# EAGLE design emonDCduo-ESP v1.3 (EAGLE 8.3.2)
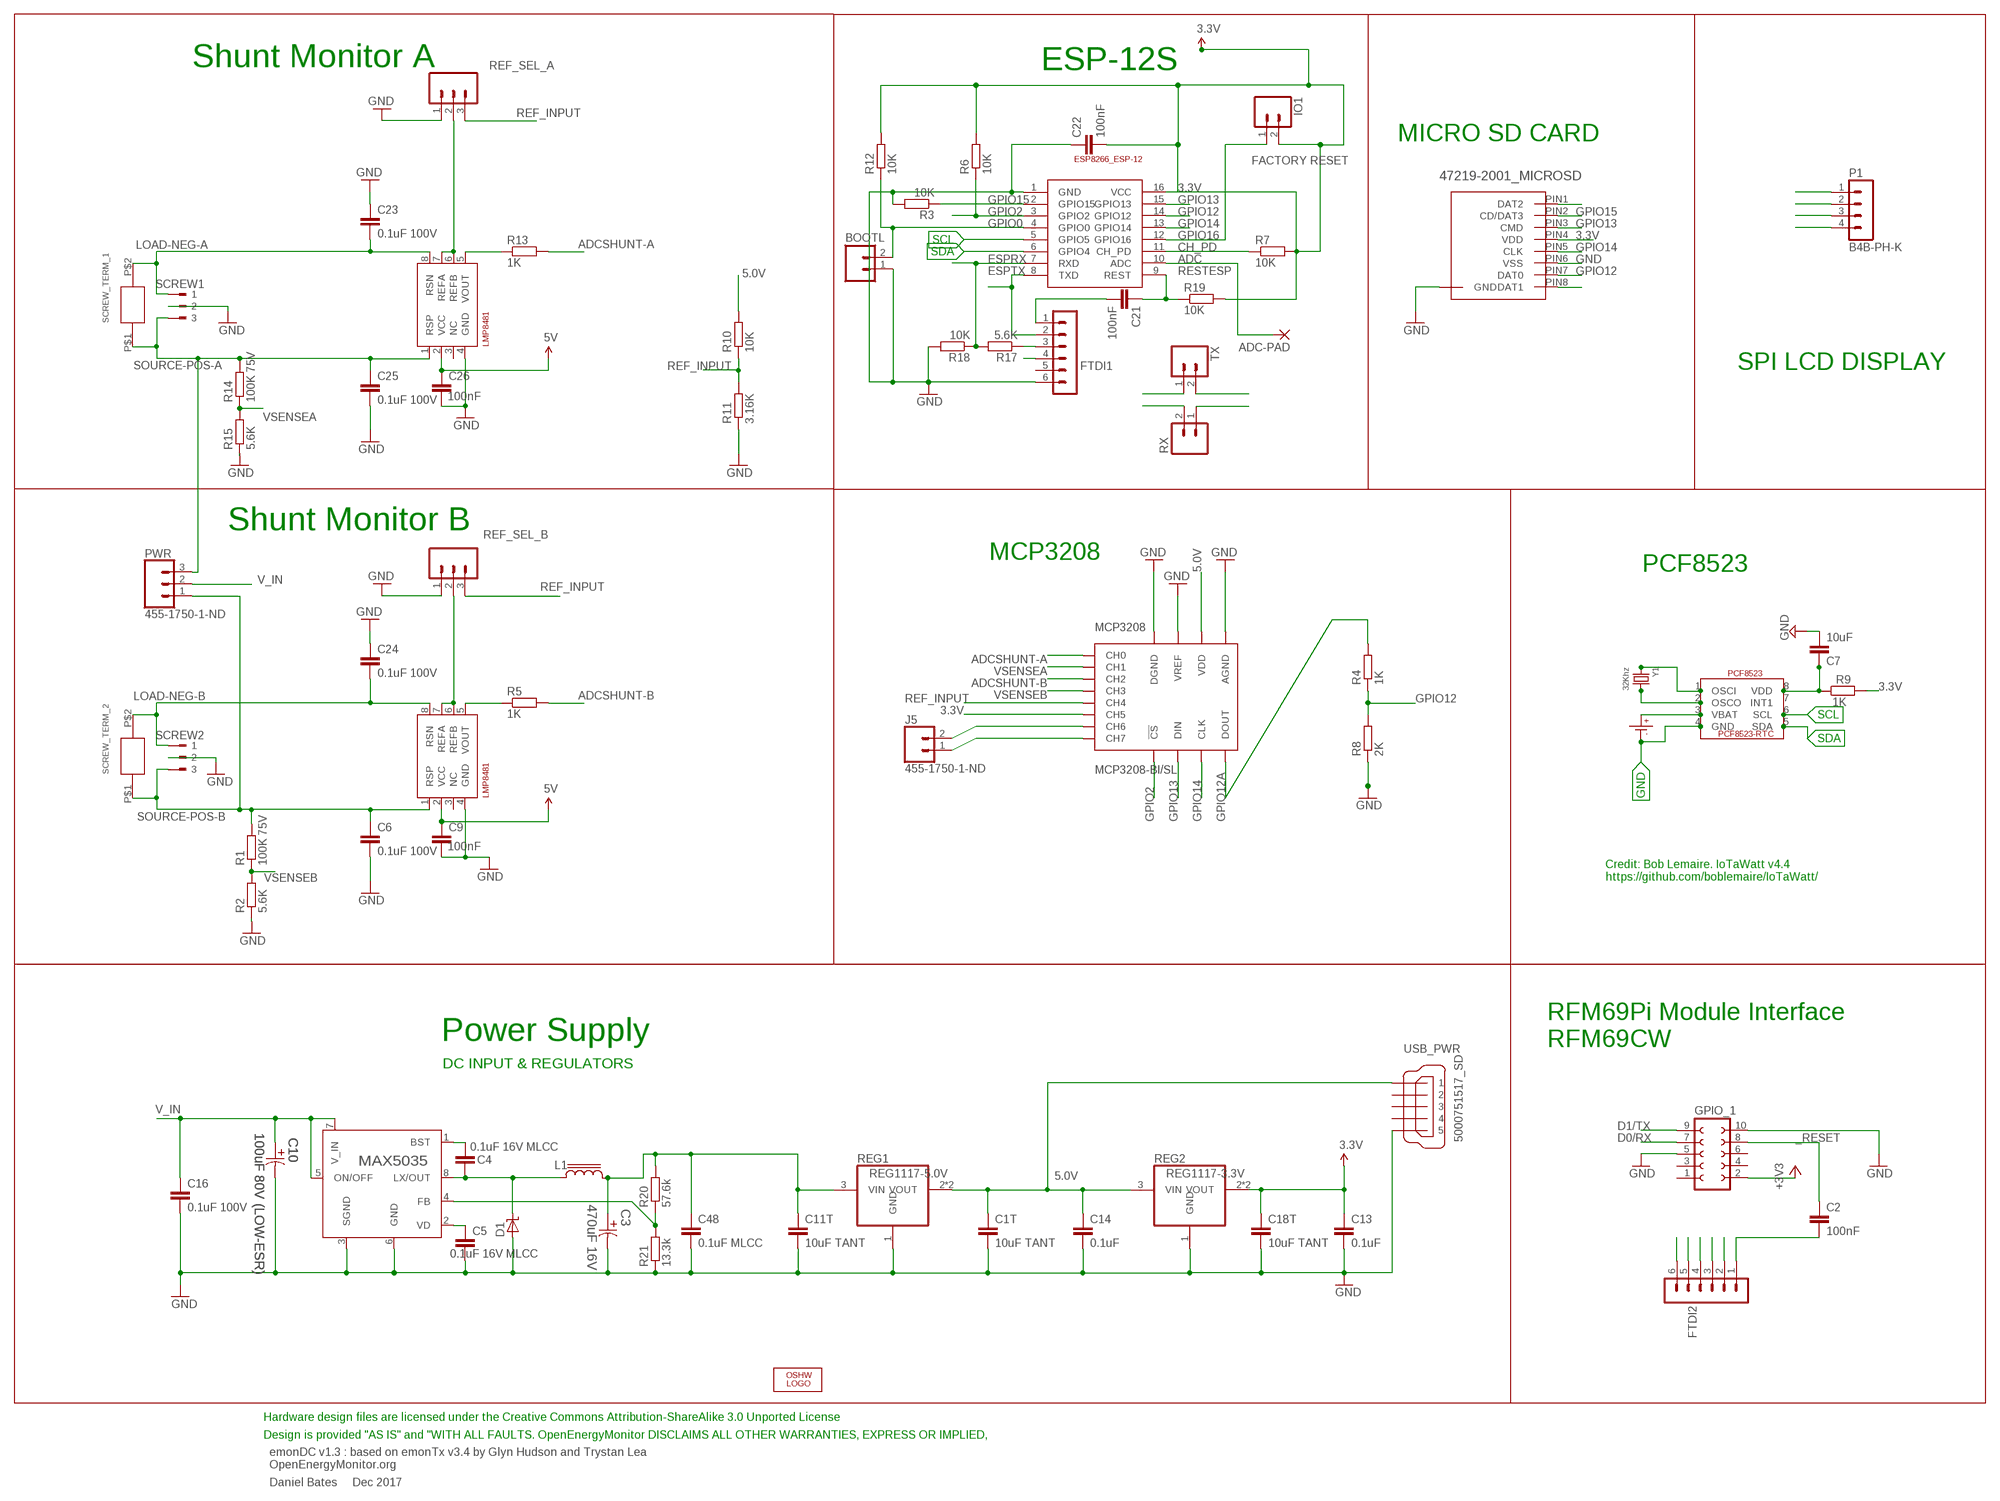
[diagram p0: schematic, sheet 1]

## Parts
ADC-PAD  2,15/1,0  [2,15/1,0]
BOOTL  M02PTH  [1X02]
C1T  10uF TANT  C-EUC0603  [C0603]
C2  100nF  C-EUC0603  [C0603]
C3  470uF 16V  EEE-FK1C471P-CASE-F  [CAPAE830X1050N]
C4  0.1uF 16V MLCC  C-EUC0603  [C0603]
C5  0.1uF 16V MLCC  C-EUC0603  [C0603]
C6  0.1uF 100V  C-EUC0603  [C0603]
C7  10uF  C-EUC0603  [C0603]
C9  100nF  C-EUC0603  [C0603]
C10  100uF 80V (LOW-ESR)  EEV-FK1K101Q-CASE-H13  [CAPAE1350X1400N]
C11T  10uF TANT  C-EUC0603  [C0603]
C13  0.1uF  C-EUC0603  [C0603]
C14  0.1uF  C-EUC0603  [C0603]
C16  0.1uF 100V  C-EUC0603  [C0603]
C18T  10uF TANT  C-EUC0603  [C0603]
C21  100nF  C-EUC0603  [C0603]
C22  100nF  C-EUC0603  [C0603]
C23  0.1uF 100V  C-EUC0603  [C0603]
C24  0.1uF 100V  C-EUC0603  [C0603]
C25  0.1uF 100V  C-EUC0603  [C0603]
C26  100nF  C-EUC0603  [C0603]
C48  0.1uF MLCC  C-EUC0603  [C0603]
CR1220  CR1220SMD  [CR1220SMD]
D1  MBRS1100T3G  [SMB_1]
ESP-12  ESP8266_ESP-12  [ESP8266-ESP12]
FTDI1  FTDI  MA06-1  [MA06-1]
FTDI2  FTDI  MA06-1  [MA06-1]
GPIO_1  FE05-2  [FE05-2]
IO1  M02PTH  [1X02]
J5  455-1750-1-ND  CONN_02  [1X02]
L1  SRR1208  [SSR1208]
LOGO1  OSHW_LOGO_6MILX0200-NT  [OSHW_6X200_NOTEXT]
MCP3208  MCP3208-BI/SL  [SOIC16]
P1  B4B-PH-K  [B4B-PH-K]
PCF8523  PCF8523_RTC  [SOIC_8]
PWR  455-1750-1-ND  CONN_03  [1X03]
R1  100K 75V  R-EU_R0603  [R0603]
R2  5.6K  R-EU_R0603  [R0603]
R3  10K  R-EU_R0603  [R0603]
R4  1K  R-EU_R0603  [R0603]
R5  1K  R-EU_R0603  [R0603]
R6  10K  R-EU_R0603  [R0603]
R7  10K  R-EU_R0603  [R0603]
R8  2K  R-EU_R0603  [R0603]
R9  1K  R-EU_R0603  [R0603]
R10  10K  R-EU_0309/12  [0309/12]
R11  3.16K  R-EU_0309/12  [0309/12]
R12  10K  R-EU_R0603  [R0603]
R13  1K  R-EU_R0603  [R0603]
R14  100K 75V  R-EU_R0603  [R0603]
R15  5.6K  R-EU_R0603  [R0603]
R17  5.6K  R-EU_R0603  [R0603]
R18  10K  R-EU_R0603  [R0603]
R19  10K  R-EU_R0603  [R0603]
R20  57.6k  R-EU_R0603  [R0603]
R21  13.3k  R-EU_R0603  [R0603]
REF_SEL_A  455-1750-1-ND  CONN_03  [1X03]
REF_SEL_B  455-1750-1-ND  CONN_03  [1X03]
REG0  MAX5035  [21-0111D_SBE-14]
REG1  REG1117-5.0V  REG1117-VOUT4  [SOT223]
REG2  REG1117-3.3V  REG1117-VOUT4  [SOT223]
RX  M02PTH  [1X02]
SCREW1  180-3  [180-3]
SCREW2  180-3  [180-3]
SCREW_TERM_1  EBW_SERIES_15.2MM  [EBW_SERIES_15.2MM]
SCREW_TERM_2  EBW_SERIES_15.2MM  [EBW_SERIES_15.2MM]
SHUNTMON-A  LMP8481  LMP8481-H  [S-PDSO-G08]
SHUNTMON-B  LMP8481  LMP8481-H  [S-PDSO-G08]
TX  M02PTH  [1X02]
U$4  47219-2001_MICROSD  [47219-2001_MICROSD]
USB_PWR  5000751517_SD  [5000751517_SD]
Y1  32Khz  CRYSTAL8X3.8SMT  [CRYSTAL_8X3.8]

## Nets
3.3V: C13.1 C18T.1 C22.2 ESP-12.16(VCC) GPIO_1.2 IO1.2 MCP3208.6(CH5) P1.3 R6.2 R7.2 R9.2 R12.2 R19.2 REG2.2(VOUT) REG2.4(VOUT) U$4.PIN4(VDD) ; supply symbol labelled +3V3
5.0V [power]: C1T.1 C9.1 C14.1 C26.1 FTDI1.4 FTDI2.4 MCP3208.16(VDD) R10.2 REG1.2(VOUT) REG1.4(VOUT) REG2.3(VIN) SHUNTMON-A.2(VCC) SHUNTMON-B.2(VCC) USB_PWR.VBUS ; supply symbol labelled 5V
6.5V: C3.1 C11T.1 C48.1 L1.2 R20.2 REG1.3(VIN)
_RESET: C2.1 GPIO_1.8
ADC: ADC-PAD.1(P) ESP-12.10(ADC)
ADCSHUNT-A: MCP3208.1(CH0) R13.2
ADCSHUNT-B: MCP3208.3(CH2) R5.2
BST: C4.1 REG0.1(BST)
CH6: J5.2 MCP3208.7(CH6)
CH7: J5.1 MCP3208.8(CH7)
CH_PD: ESP-12.11(CH_PD) R7.1
D0/RX: FTDI2.2 GPIO_1.7 TX.2
D1/TX: FTDI2.3 GPIO_1.9 RX.1
ESPRX: ESP-12.7(RXD) R17.2 R18.1 RX.2
ESPTX: ESP-12.8(TXD) FTDI1.2 TX.1
FB: R20.1 R21.2 REG0.4(FB)
GND [thin_power]: BOOTL.1 C1T.2 C3.2 C5.2 C6.2 C7.2 C9.2 C10.2 C11T.2 C13.2 C14.2 C16.2 C18T.2 C22.1 C23.1 C24.1 C25.2 C26.2 C48.2 CR1220.P-(P$-) D1.A ESP-12.1(GND) FTDI1.6 FTDI2.6 GPIO_1.5 GPIO_1.10 MCP3208.9(DGND) MCP3208.14(AGND) MCP3208.15(VREF) P1.4 PCF8523.4(GND) R2.1 R3.2 R8.1 R11.1 R15.1 R18.2 R21.1 REF_SEL_A.1 REF_SEL_B.1 REG0.3(SGND) REG0.6(GND) REG1.1(GND) REG2.1(GND) SCREW1.2 SCREW2.2 SHUNTMON-A.4(GND) SHUNTMON-B.4(GND) U$4.P$1(GND) U$4.P$2(GND) U$4.P$3(GND) U$4.P$4(GND) U$4.PIN6(VSS) USB_PWR.GND1 USB_PWR.GND2 USB_PWR.GND3
GPIO0: BOOTL.2 ESP-12.4(GPIO0) R12.1
GPIO2: ESP-12.3(GPIO2) MCP3208.10(!CS) R6.1
GPIO12: ESP-12.14(GPIO12) R4.1 R8.2 U$4.PIN7(DAT0)
GPIO12A: MCP3208.12(DOUT) R4.2
GPIO13: ESP-12.15(GPIO13) MCP3208.11(DIN) U$4.PIN3(CMD)
GPIO14: ESP-12.13(GPIO14) MCP3208.13(CLK) U$4.PIN5(CLK)
GPIO15 [thin_power]: ESP-12.2(GPIO15) R3.1 U$4.PIN2(CD/DAT3)
GPIO16: ESP-12.12(GPIO16) IO1.1
LOAD-NEG-A: C23.2 SCREW1.1 SCREW_TERM_1.P$2 SHUNTMON-A.8(RSN)
LOAD-NEG-B: C24.2 SCREW2.1 SCREW_TERM_2.P$2 SHUNTMON-B.8(RSN)
LX: C4.2 D1.C L1.1 REG0.8(LX/OUT)
N$4: R13.1 SHUNTMON-A.5(VOUT)
N$6: R5.1 SHUNTMON-B.5(VOUT)
N$7: U$4.PIN1(DAT2)
N$10: C7.1 PCF8523.8(VDD) R9.1
N$20: FTDI2.5
N$30: C21.2 FTDI1.1
N$32: U$4.PIN8(DAT1)
N$36: FTDI1.3 R17.1
N$43: CR1220.P+(P$+) PCF8523.3(VBAT)
N$44: PCF8523.2(OSCO) Y1.P$4
N$45: PCF8523.1(OSCI) Y1.P$1
N$301: C2.2 FTDI2.1
REF_A_INPUT: REF_SEL_A.2 SHUNTMON-A.6(REFB) SHUNTMON-A.7(REFA)
REF_B_INPUT [thin_power]: REF_SEL_B.2 SHUNTMON-B.6(REFB) SHUNTMON-B.7(REFA)
REF_INPUT: MCP3208.5(CH4) R10.1 R11.2 REF_SEL_A.3 REF_SEL_B.3
RESTESP: C21.1 ESP-12.9(REST) R19.1
SCL: ESP-12.5(GPIO5) P1.2 PCF8523.6(SCL)
SDA: ESP-12.6(GPIO4) P1.1 PCF8523.5(SDA)
SOURCE-POS-A: C25.1 PWR.3 R14.2 SCREW1.3 SCREW_TERM_1.P$1 SHUNTMON-A.1(RSP)
SOURCE-POS-B: C6.1 PWR.1 R1.2 SCREW2.3 SCREW_TERM_2.P$1 SHUNTMON-B.1(RSP)
V_IN: C10.1 C16.1 PWR.2 REG0.5(ON/OFF) REG0.7(V_IN)
VD: C5.1 REG0.2(VD)
VSENSEA: MCP3208.2(CH1) R14.1 R15.2
VSENSEB: MCP3208.4(CH3) R1.1 R2.2
Unconnected: FTDI1.5 GPIO_1.1 GPIO_1.3 GPIO_1.4 GPIO_1.6 PCF8523.7(INT1) SHUNTMON-A.3(NC) SHUNTMON-B.3(NC) USB_PWR.D+ USB_PWR.D- USB_PWR.ID

## Notes on the sheet
- Shunt Monitor A | ESP-12S
- MICRO SD CARD
- FACTORY RESET
- SPI LCD DISPLAY
- Shunt Monitor B
- MCP3208
- PCF8523
- Credit: Bob Lemaire. IoTaWatt v4.4
  https://github.com/boblemaire/IoTaWatt/
- Power Supply
- RFM69Pi Module Interface
  RFM69CW
- DC INPUT & REGULATORS
- Hardware design files are licensed under the Creative Commons Attribution-ShareAlike 3.0 Unported License
- Design is provided "AS IS" and "WITH ALL FAULTS. OpenEnergyMonitor DISCLAIMS ALL OTHER WARRANTIES, EXPRESS OR IMPLIED,
- emonDC v1.3 : based on emonTx v3.4 by Glyn Hudson and Trystan Lea
  OpenEnergyMonitor.org
- Daniel Bates     Dec 2017

## Library data of the parts
ADC-PAD = wirepad:2,15/1,0: THROUGH-HOLE PAD
BOOTL IO1 RX TX = SparkFun:M02: Header 2 Standard 2-pin 0.1" header. Use with straight break away headers (SKU : PRT-00116), right angle break away headers (PRT-00553), swiss pins (PRT-00743), machine pins (PRT-00117), and female headers (PRT-00115). Molex polarized connector foot print use with SKU : PRT-08233 with associated crimp pins and housings.
C1T C2 C4 C5 C7 C11T C13 C14 C16 C18T C21 C22 C48 = rcl:C-EU: CAPACITOR, European symbol
C3 = Panasonic-EEEFK_EEEFP:EEE-: Aluminum Electrolytic Capacitors,Surface Mount Type; MPN: EEE-FK1C471P; OC_FARNELL: 9695710; OC_NEWARK: 96K9385; PACKAGE: CASE-F; SUPPLIER: PANASONIC; TOLERANCE: ±20 %; VALUE: 470UF; VOLTAGERATING: 16V
C6 C9 C23-C26 = rcl:C-EU: CAPACITOR, European symbol; MPN: C1608X7S2A104K080AB
C10 = Panasonic-EEE-EEV-EEF-ECQ:EEV-: Aluminum Electrolytic Capacitors,Surface Mount Type; MPN: EEVFK1K101Q; OC_FARNELL: 9696113; OC_NEWARK: 96K9484; SUPPLIER: PANASONIC; TOLERANCE: ±20 %; VALUE: 100UF; VOLTAGERATING: 80V
CR1220 = IotaWatt_parts:CR1220SMD: CR1220 Battery SMD; MPN: Harwin S8411-45R
D1 = diodes:MBRS1100T3G: MBRS1100T3G 100V 1A Freewheeling Diode; MPN: MBRS1100T3G
ESP-12 = ESP8266-ESP12:ESP8266_ESP-12
FTDI1 FTDI2 = JeeLabs:MA06-1: PIN HEADER
GPIO_1 = con-lsta:FE05-2: FEMALE HEADER; OC_FARNELL: unknown; OC_NEWARK: unknown
J5 = SparkFun-Connectors:CONN_02: Multi connection point. Often used as Generic Header-pin footprint for 0.1 inch spaced/style header connections On any of the 0.1 inch spaced packages, you can populate with these: Break Away Headers - Straight <https://www.sparkfun.com/products/116> (PRT-00116) Break Away Male Headers - Right Angle <https://www.sparkfun.com/products/553> (PRT-00553) Female Headers <https://www.sparkfun.com/products/115> (PRT-00115) Break Away Headers - Machine Pin <https://www.sparkfun.com/products/117> (PRT-00117) Break Away Female Headers - Swiss Machine Pin <https://www.sparkfun.com/products/743> (PRT-00743) For SCREWTERMINALS and SPRING TERMINALS visit here: Screw Terimnals on SparkFun.com <https://www.sparkfun.com/search/results?term=Screw+Terminals> (5mm/3.5mm/2.54mm spacing) This device is also useful as a general connection point to wire up your design to another part of your project. Our various solder wires solder well into these plated through hole pads. Hook-Up Wire - Assortment (Stranded, 22 AWG) <https://www.sparkfun.com/products/11375> (PRT-11375) Hook-Up Wire - Assortment (Solid Core, 22 AWG) <https://www.sparkfun.com/products/11367> (PRT-11367) View the entire wire category on our website here <https://www.sparkfun.com/categories/141> Special notes: Molex polarized connector foot print use with: PRT-08233 with associated crimp pins and housings. 2.54_SCREWTERM for use with PRT-10571. 3.5mm Screw Terminal footprints for PRT-08084 5mm Screw Terminal footprints for use with PRT-08432
L1 = inductor-bourns:SRR1208: POWER INDUCTOR; MPN: SRR1208-151YL
LOGO1 = ohw-logo:OSHW_LOGO_6MIL; OC_FARNELL: unknown
MCP3208 = MCP3208:MCP3208
P1 = jst-ph:B4B-PH-K: HEADER
PCF8523 = IotaWatt_parts:PCF8523_RTC: PCF8523-RTC SOIC-8
PWR = SparkFun-Connectors:CONN_03: Multi connection point. Often used as Generic Header-pin footprint for 0.1 inch spaced/style header connections On any of the 0.1 inch spaced packages, you can populate with these: Break Away Headers - Straight <https://www.sparkfun.com/products/116> (PRT-00116) Break Away Male Headers - Right Angle <https://www.sparkfun.com/products/553> (PRT-00553) Female Headers <https://www.sparkfun.com/products/115> (PRT-00115) Break Away Headers - Machine Pin <https://www.sparkfun.com/products/117> (PRT-00117) Break Away Female Headers - Swiss Machine Pin <https://www.sparkfun.com/products/743> (PRT-00743) Stackable Header - 3 Pin (Female, 0.1") <https://www.sparkfun.com/products/13875> (PRT-13875) For SCREWTERMINALS and SPRING TERMINALS visit here: Screw Terimnals on SparkFun.com <https://www.sparkfun.com/search/results?term=Screw+Terminals> (5mm/3.5mm/2.54mm spacing) This device is also useful as a general connection point to wire up your design to another part of your project. Our various solder wires solder well into these plated through hole pads. Hook-Up Wire - Assortment (Stranded, 22 AWG) <https://www.sparkfun.com/products/11375> (PRT-11375) Hook-Up Wire - Assortment (Solid Core, 22 AWG) <https://www.sparkfun.com/products/11367> (PRT-11367) View the entire wire category on our website here <https://www.sparkfun.com/categories/141> Special notes: Molex polarized connector foot print use with SKU : PRT-08232 with associated crimp pins and housings.; PROD_ID: XXX-00000
R1 R14 = rcl:R-EU_: RESISTOR, European symbol; MPN: MCWR06X1003FTL
R2 R4 R8 R15 = rcl:R-EU_: RESISTOR, European symbol; MPN: MCWR06X5901FTL
R3 R5-R7 R9-R13 R17-R21 = rcl:R-EU_: RESISTOR, European symbol
REF_SEL_A REF_SEL_B = SparkFun-Connectors:CONN_03: Multi connection point. Often used as Generic Header-pin footprint for 0.1 inch spaced/style header connections On any of the 0.1 inch spaced packages, you can populate with these: Break Away Headers - Straight <https://www.sparkfun.com/products/116> (PRT-00116) Break Away Male Headers - Right Angle <https://www.sparkfun.com/products/553> (PRT-00553) Female Headers <https://www.sparkfun.com/products/115> (PRT-00115) Break Away Headers - Machine Pin <https://www.sparkfun.com/products/117> (PRT-00117) Break Away Female Headers - Swiss Machine Pin <https://www.sparkfun.com/products/743> (PRT-00743) Stackable Header - 3 Pin (Female, 0.1") <https://www.sparkfun.com/products/13875> (PRT-13875) For SCREWTERMINALS and SPRING TERMINALS visit here: Screw Terimnals on SparkFun.com <https://www.sparkfun.com/search/results?term=Screw+Terminals> (5mm/3.5mm/2.54mm spacing) This device is also useful as a general connection point to wire up your design to another part of your project. Our various solder wires solder well into these plated through hole pads. Hook-Up Wire - Assortment (Stranded, 22 AWG) <https://www.sparkfun.com/products/11375> (PRT-11375) Hook-Up Wire - Assortment (Solid Core, 22 AWG) <https://www.sparkfun.com/products/11367> (PRT-11367) View the entire wire category on our website here <https://www.sparkfun.com/categories/141> Special notes: Molex polarized connector foot print use with SKU : PRT-08232 with associated crimp pins and housings.; MF: MULTICOMP; MPN: 2212S-02SG-85; OC_FARNELL: 1593458; PROD_ID: XXX-00000
REG0 = MAX5035:MAX5035: SWITCHING REGULATOR 5.0V 1.0A; MANUFACTURER_PART_NUMBER: MAX5035EASA+; MPN: MAX5035EASA+; VENDOR: MAXIM
REG1 = burr-brown:REG1117-VOUT4: 800mA and 1A Low Dropout (LDO) Positive Regulator 1.8V, 2.5V, 2.85V, 3.3V, 5V, and Adj; MF: TEXAS INSTRUMENTS; MPN: REG1117-5.0; OC_FARNELL: 1097566; OC_NEWARK: 14P6981
REG2 = burr-brown:REG1117-VOUT4: 800mA and 1A Low Dropout (LDO) Positive Regulator 1.8V, 2.5V, 2.85V, 3.3V, 5V, and Adj; MF: TEXAS INSTRUMENTS; MPN: REG1117-3.3; OC_FARNELL: 1097566; OC_NEWARK: 14P6981
SCREW1 SCREW2 = con-weidmueller-sl35:180-3: WEIDMUELLER CLAMP CONNECTOR; OC_FARNELL: unknown; OC_NEWARK: unknown
SCREW_TERM_1 SCREW_TERM_2 = EBW series shunt:EBW_SERIES_15.2MM
SHUNTMON-A = lmp8481b:LMP8481: LMP8481MM-H/NOPB 100V/V; MF: TEXAS INSTRUMENTS; MPN: LMP8481MME-S/NOPB; OC_FARNELL: 2322044
SHUNTMON-B = lmp8481b:LMP8481: LMP8481MM-H/NOPB 100V/V; MF: TEXAS INSTRUMENTS; MPN: LMP8481MME-H/NOPB; OC_FARNELL: 2322044
U$4 = MOLEX 47219-2001:47219-2001_MICROSD
USB_PWR = 5000751517_sd:5000751517_SD
Y1 = microbuilder:CRYSTAL: Crystals HC49UP - Surface Mount Crystal 4.0MHz 18pF +/-30ppm Surface Mount Crystal [Digikey: 535-9857-1-ND] 12.0 MHz Surface Mount Crystal [Digikey: 535-9869-6-ND] 25.0 MHz Surface Mount Crystal [Digikey: 535-9078-1-ND] 2.5 x 2.0mm - MEMs SMT Crystal 16.0 MHz 10pF 20ppm 2.5 x 2.0mm Crystal [Digikey -40-85°C: 535-10923-1-ND] 3.2 x 2.5mm - MEMs SMT Crystal 12.0 MHz 8pF 15ppm 3.2 x 2.5mm Crystal [Digikey: -10-70°C: 644-1047-1-ND -40-125°C: 644-1128-1-ND] 16.0 MHz 8pF 15ppm 3.2 x 2.5mm Crystal [Digikey: -10-70°C: 644-1049-1-ND -40-125°C: 644-1129-2-ND] 16.0 MHz 10pF 10ppm 3.2 x 2.5mm Crystal [Digikey: 644-1100-1-ND] 27.12 MHz 18pF 30ppm 3.2 x 2.5mm Crystal [Digikey: 887-1424-1-ND] 27.12MHz 10pF 10ppm 3.2 x 2.5mm Crystal [Digikey: 887-1329-1-ND] 4.9 x 1.8mm - MEMs SMT Crystal 32.768 KHz 12.5pF 20ppm 4.9 x 1.8mm Crystal [Digikey: SE2415CT-ND] 8.0 x 3.8mm - Surface Mount Crystal 32.768kHz 12.5pF 20ppm -40°C-85°C [Digikey: 535-9166-2-ND] Cylinder 32.768KHz Cylinder Crystal (2x6mm body) [Ex. Digikey: 300-8341-2-ND]

## Net classes
2 thin_power: width 0.254 mm

## Board
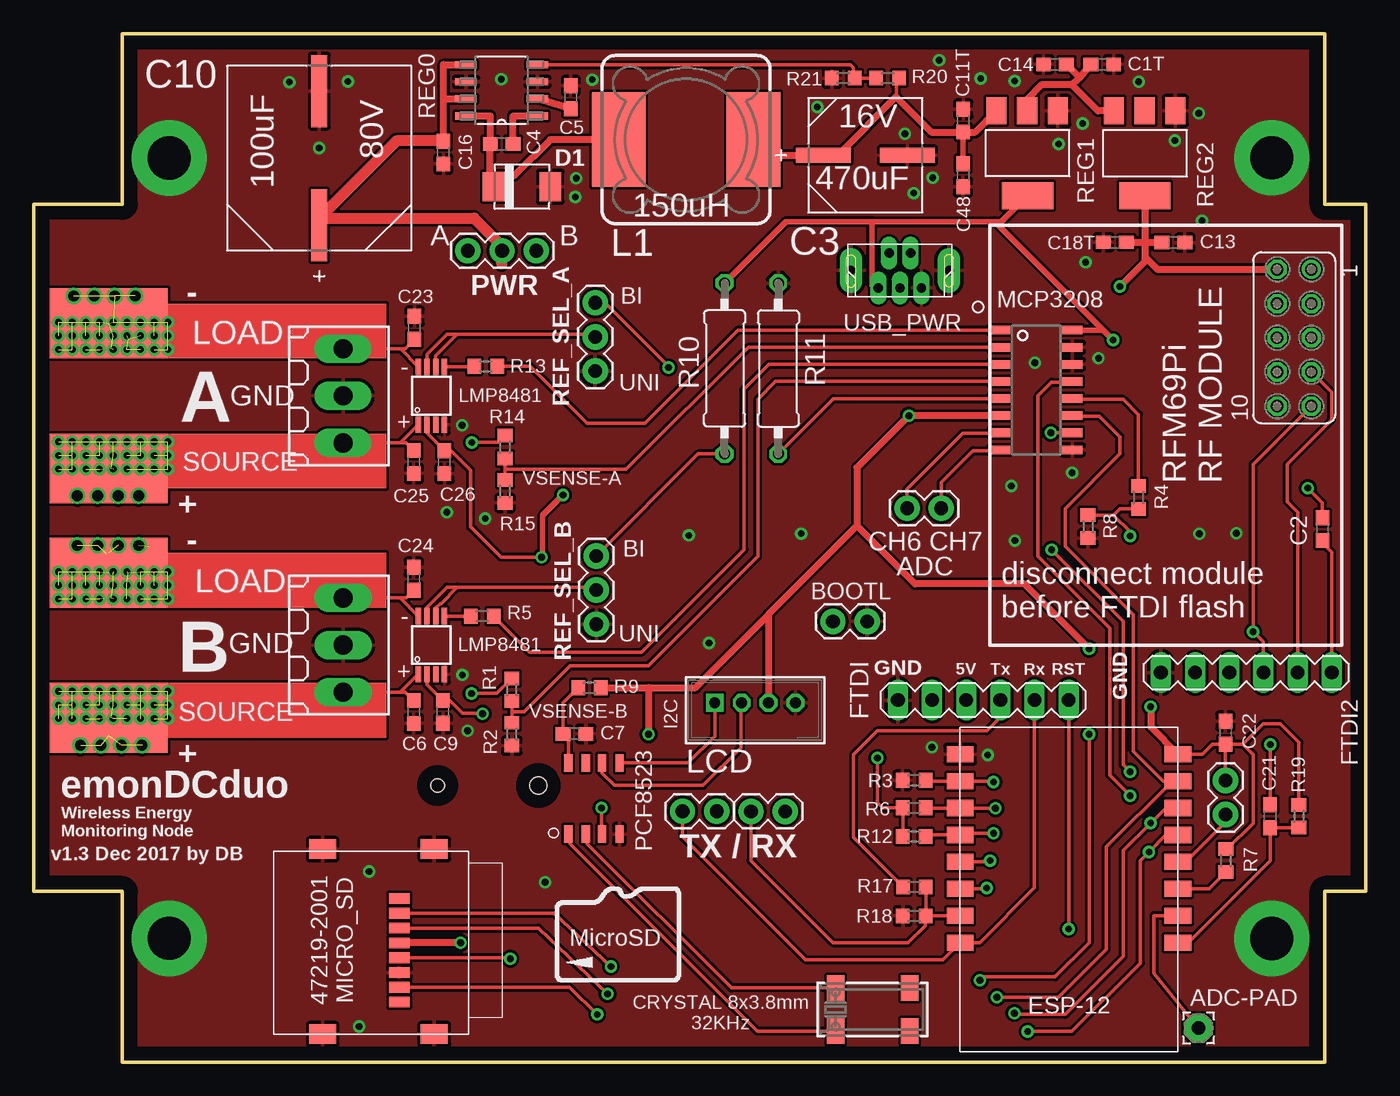
[diagram p1: board, top side]
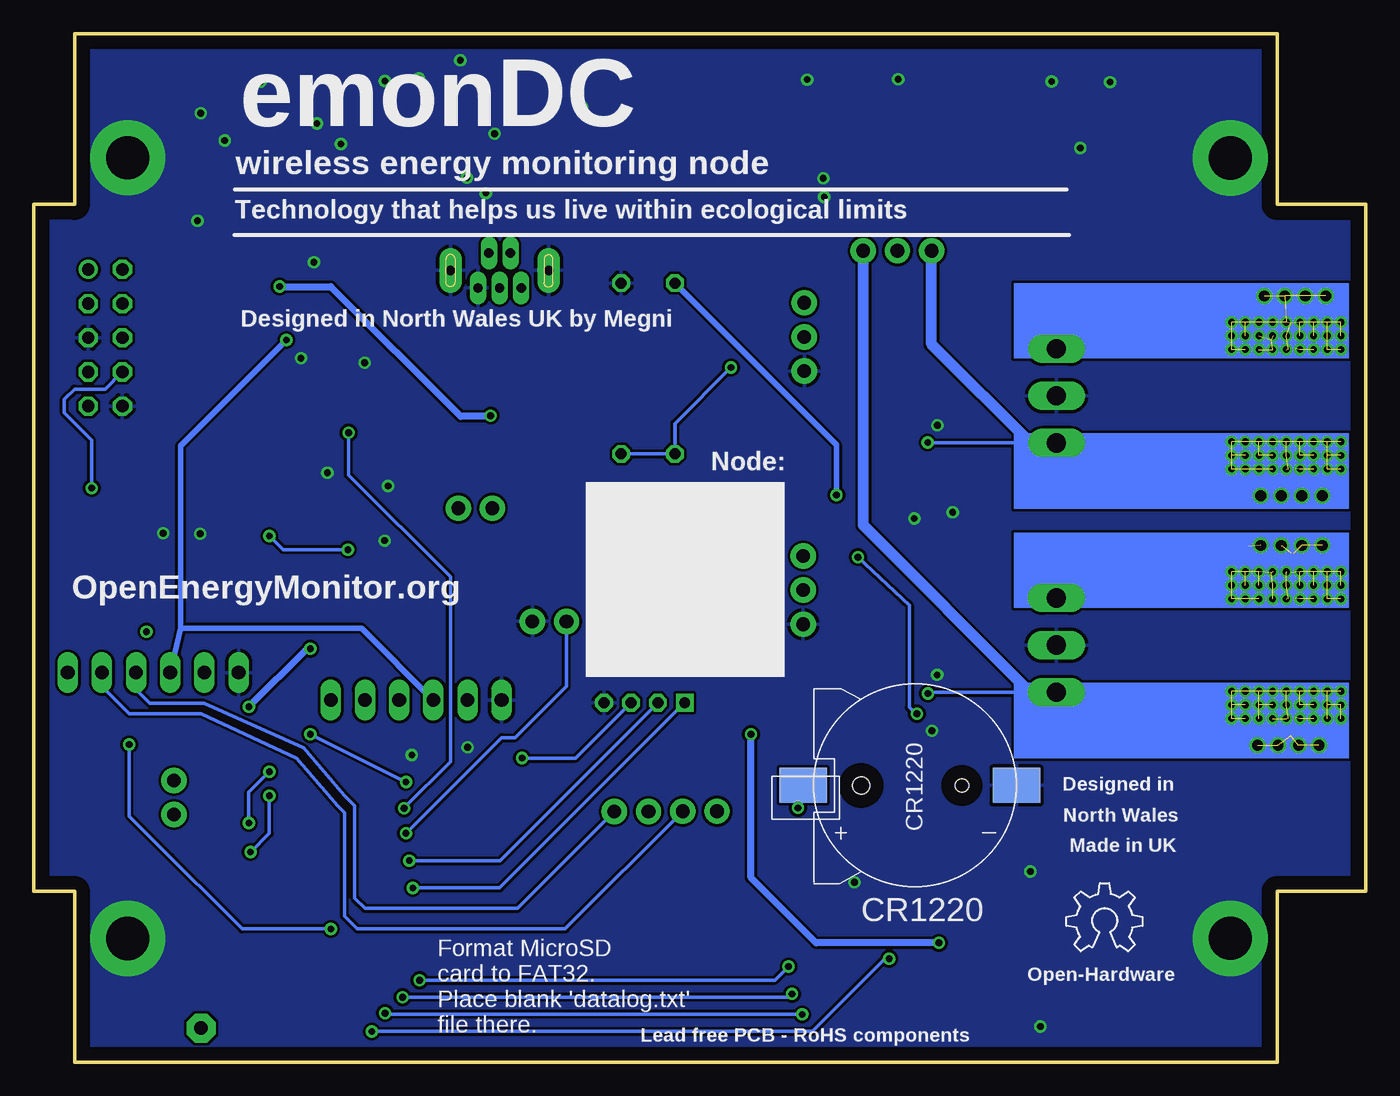
[diagram p2: board, bottom side, seen from below]

Size 99.06 x 76.45 mm. Coordinates in mm from the lower left corner, seen from the top.
Outline: 6.6,63.75 6.6,76.45 96.01,76.45 96.01,63.75 99.06,63.75 99.06,12.7 96.01,12.7 96.01,0 6.6,0 6.6,12.7 0,12.7 0,63.75 6.6,63.75
Copper layers (1*16): Top 0.035mm / dielectric 1.5mm / Bottom 0.035mm
Design rules "default *": minimum track width 10mil, minimum drill 19mil, track to track 8mil, track to pad 8mil, pad to pad 8mil, via to via 8mil, smd to smd 8mil, copper to edge 40mil, drill to drill 8mil, minimum pad ring 10mil, minimum via ring 8mil, stop-mask expansion 4mil, vias tented up to drill 0mil, thermal gap 10mil

### Footprints (pad centres in the part's own frame; a part is rotated, then mirrored left to right if it is on the bottom)
2,15/1,0 = drill 1.016 pad 2.159 octagon: 1 0,0
1X02 = drill 1.016 pad 1.88: 1 0,0; 2 2.54,0
C0603 = smd 1.1 x 1: 1 -0.85,0; 2 0.85,0
CAPAE830X1050N = smd 4.064 x 1.092: 1 -3.124,0; 2 3.124,0
CAPAE1350X1400N = smd 5.359 x 1.194: 1 -4.978,0; 2 4.978,0
CR1220SMD = smd 3.54 x 2.6: P+ 8.3,0; P- -7.55,0 | hole 1: -3.5,0 | hole 1.3: 4,0
SMB_1 = smd 1.62 x 2.18: A 2.11,0; C -2.11,0
ESP8266-ESP12 = smd 2 x 1.2: 1 16.2,2; 2 16.2,4; 3 16.2,6; 4 16.2,8; 5 16.2,10; 6 16.2,12; 7 16.2,14; 8 16.2,16; 9 0,16; 10 0,14; 11 0,12; 12 0,10; 13 0,8; 14 0,6; 15 0,4; 16 0,2
MA06-1 = drill 1.016 long: 1 0,0; 2 2.54,0; 3 5.08,0; 4 7.62,0; 5 10.16,0; 6 12.7,0
FE05-2 = drill 0.914: 1 -5.08,1.27 | drill 0.914 octagon: 2 -5.08,-1.27; 3 -2.54,1.27; 4 -2.54,-1.27; 5 0,1.27; 6 0,-1.27; 7 2.54,1.27; 8 2.54,-1.27; 9 5.08,1.27; 10 5.08,-1.27
SSR1208 = smd 7 x 4: 1 0,5; 2 0,-5
SOIC16 = smd 0.635 x 1.524: 1 -4.445,-2.695; 2 -3.175,-2.695; 3 -1.905,-2.695; 4 -0.635,-2.695; 5 0.635,-2.695; 6 1.905,-2.695; 7 3.175,-2.695; 8 4.445,-2.695; 9 4.445,2.695; 10 3.175,2.695; 11 1.905,2.695; 12 0.635,2.695; 13 -0.635,2.695; 14 -1.905,2.695; 15 -3.175,2.695; 16 -4.445,2.695
B4B-PH-K = drill 0.813 square: 1 -3,0 | drill 0.813 octagon: 2 -1,0; 3 1,0; 4 3,0
SOIC_8 = smd 1.3 x 0.6: 1 -2.6,1.9; 2 -2.6,0.6; 3 -2.6,-0.6; 4 -2.6,-1.9; 5 2.7,-1.9; 6 2.7,-0.6; 7 2.7,0.6; 8 2.7,1.9
1X03 = drill 1.016 pad 1.88: 1 0,0; 2 2.54,0; 3 5.08,0
R0603 = smd 1 x 1.1: 1 -0.85,0; 2 0.85,0
0309/12 = drill 0.813 octagon: 1 -6.35,0; 2 6.35,0
21-0111D_SBE-14 = smd 1.6 x 0.533: 1 -2.654,1.905; 2 -2.654,0.635; 3 -2.654,-0.635; 4 -2.654,-1.905; 5 2.654,-1.905; 6 2.654,-0.635; 7 2.654,0.635; 8 2.654,1.905
SOT223 = smd 1.499 x 2.007: 1 -2.261,-3.15; 2 0.025,-3.15; 3 2.311,-3.15 | smd 3.81 x 2.007: 4 0,3.15
180-3 = drill 1.422 long: 1 -3.5,0; 2 0,0; 3 3.5,0
EBW_SERIES_15.2MM = smd 5.2 x 8.75: P$1 -5.4,0; P$2 5.4,0
S-PDSO-G08 = smd 0.4 x 1.2: 1 -0.975,-2.157; 2 -0.325,-2.157; 3 0.325,-2.157; 4 0.975,-2.157; 5 0.975,2.157; 6 0.325,2.157; 7 -0.325,2.157; 8 -0.975,2.157
47219-2001_MICROSD = smd 1.45 x 2: P$1 0,0; P$2 13.75,0; P$3 0,8.3; P$4 13.75,8.3 | smd 0.8 x 1.5: PIN1 10.08,2.6; PIN2 8.98,2.6; PIN3 7.88,2.6; PIN4 6.78,2.6; PIN5 5.68,2.6; PIN6 4.58,2.6; PIN7 3.48,2.6; PIN8 2.38,2.6
5000751517_SD = drill 0.7 pad 1.016 long: D+ 0,-1.3; D- -0.8,1.3; GND1 1.6,-1.3; ID 0.8,1.3; VBUS -1.6,-1.3 | drill 0.7 pad 1.676 long: GND2 3.65,0; GND3 -3.65,0
CRYSTAL_8X3.8 = smd 1.3 x 1.9: P$1 -2.75,-1.6; P$2 2.75,-1.6; P$3 2.75,1.6; P$4 -2.75,1.6

### Placement (x,y rotation side)
ADC-PAD  86.61,2.54 0 top
BOOTL  61.98,32.77 180 top
C1T  79.45,74.17 0 top
C2  95.83,39.63 270 top
C3  61.85,67.41 0 top
C4  34.81,68.25 180 top
C5  39.94,71.72 90 top
C6  28.27,26.03 270 top
C7  40.21,24.41 0 top
C9  30.43,26.04 270 top
C10  21.23,67.2 90 top
C11T  69.12,69.99 90 top
C13  84.74,60.93 0 top
C14  75.95,74.17 180 top
C16  30.47,67.62 270 top
C18T  80.4,60.95 180 top
C21  91.95,18.29 90 top
C22  88.62,24.49 270 top
C23  28.31,54.59 270 top
C24  28.27,35.94 270 top
C25  28.27,44.62 270 top
C26  30.55,44.6 270 top
C48  69.1,65.93 270 top
CR1220  33.53,20.57 180 bottom
D1  36.31,65.08 0 top
ESP-12  85.09,24.89 180 top
FTDI1  76.96,26.92 180 top
FTDI2  96.52,28.96 180 top
GPIO_1  93.73,53.85 270 top
IO1  88.62,18.41 90 top
J5  67.49,41.18 180 top
L1  48.51,68.58 90 top
LOGO1  22.27,8.23 0 bottom
MCP3208  74.54,49.96 270 top
P1  53.65,26.72 0 top
PCF8523  41.66,19.56 90 top
PWR  37.37,60.32 180 top
R1  35.56,27.69 90 top
R2  35.56,24.38 90 top
R3  65.46,20.96 180 top
R4  82.16,41.98 90 top
R5  33.36,33.16 0 top
R6  65.47,18.91 180 top
R7  88.65,14.99 90 top
R8  78.4,39.81 90 top
R9  41.33,27.84 0 top
R10  51.38,51.56 90 top
R11  55.37,51.56 270 top
R12  65.47,16.78 180 top
R13  33.61,51.73 0 top
R14  35.05,45.72 90 top
R15  35.05,42.42 90 top
R17  65.49,13.03 0 top
R18  65.47,10.87 180 top
R19  94.08,18.29 90 top
R20  63.5,73.15 0 top
R21  60.2,73.15 0 top
REF_SEL_A  41.76,51.37 90 top
REF_SEL_B  41.84,32.56 90 top
REG0  34.8,72.24 180 top
REG1  73.9,67.57 180 top
REG2  82.63,67.56 180 top
RX  55.88,18.64 180 top
SCREW1  23,49.53 270 top
SCREW2  23.01,31.01 270 top
SCREW_TERM_1  5.59,49.53 90 top
SCREW_TERM_2  5.59,30.99 90 top
SHUNTMON-A  29.57,49.55 0 top
SHUNTMON-B  29.57,31.01 0 top
TX  48.25,18.65 0 top
U$4  29.79,2.09 90 top
USB_PWR  64.41,58.86 0 top
Y1  62.38,3.92 0 top

### Tracks (layer width: path | path; a pad name or v marks a point on that pad's centre or on a via)
3.3V  (via drill 0.5)
  Top 0.254: R12.2 R6.2 63.13,18.91 62.74,19.3 v62.74,22.61 | 88.62,23.62 C22.2 | 88.62,23.62 88.62,20.95 IO1.2 | 88.62,23.62 87.63,23.62 86.9,22.89 ESP-12.16 85.06,22.89 | R19.2 94.08,23.77 92.71,25.15 91.44,25.15 89.92,23.62 | 89.92,23.62 88.62,23.62 | R7.2 88.73,15.84 90.68,17.78 90.68,22.86 89.92,23.62 | 54.65,33.27 54.65,33.31
  Top 0.406: 82.8,60.96 82.63,61.13 82.44,60.95 | 83.86,60.96 C13.1
  Top 0.508: MCP3208.6 v65.08,48.06 61.21,44.2 61.21,39.88 | 61.21,39.88 65.53,35.56 73.66,35.56 v78.49,30.73 | P1.3 54.65,33.27 49.21,27.84 45.72,27.84 | 54.65,33.31 61.21,39.88 | 45.72,27.84 v45.72,24.38 | v83.06,26.42 83.06,24.92 ESP-12.16 | R9.2 45.72,27.84 | v31.74,8.87 U$4.PIN4
  Top 0.533: REG2.4 82.63,61.13 82.63,59.87 | 82.8,60.96 83.86,60.96 | C18T.1 82.44,60.95 | 82.63,59.87 83.57,58.93 GPIO_1.2 | 82.63,59.87 82.63,59.52 v80.77,57.66
  Bottom 0.254: v62.74,22.61 58.76,22.61 P1.3 | 78.74,30.73 v78.49,30.73
  Bottom 0.406: v65.08,48.06 65.13,48.01
  Bottom 0.508: v80.77,57.66 76.96,57.66 67.31,48.01 65.13,48.01 | v45.72,24.38 45.72,13.72 40.88,8.87 v31.74,8.87 | v83.06,26.42 78.74,30.73
5.0V  (via drill 0.5)
  Top 0.254: SHUNTMON-A.2 29.25,46.76 C26.1 30.6,45.4 31.09,45.4 32.49,44.01 32.49,39.8 34.74,37.54 v37.76,37.54 37.8,38.3 37.85,37.59 | SHUNTMON-B.2 29.25,28.07 C9.1 30.43,26.86 30.95,26.86 31.88,25.92 33.09,25.92 33.23,25.78 v33.39,25.9
  Top 0.406: REG1.2 73.88,71.59 | 77.72,73.15 77.72,73.24 77.74,73.19 | R10.2 55.95,62.48 62.35,62.48 | 62.35,62.48 71.46,62.48 | 72.55,64.42 REG1.4 71.97,62.48 71.46,62.48 | USB_PWR.VBUS 62.35,57.77 62.35,62.48 | v39.37,42.16 37.85,40.64 37.85,37.59 | 71.46,62.48 v80.27,53.68 79.54,54.41 MCP3208.16
  Top 0.533: 73.88,71.59 74.93,72.64 77.22,72.64 | 77.22,72.64 77.72,73.15 | 77.72,73.24 C14.1 | 77.74,73.19 C1T.1 | REG2.3 79.15,70.71 77.22,72.64
  Bottom 0.254: v37.76,37.54 33.95,33.98 33.95,26.37 33.37,25.78 v33.39,25.9
  Bottom 0.406: 88.14,32.26 FTDI2.4 | 88.14,32.26 88.14,45.81 v80.27,53.68 | R10.2 39.37,45.91 v39.37,42.16 | FTDI1.4 74.68,32.26 88.14,32.26
6.5V
  Top 0.254: 64.13,71.75 64.14,71.86 64.14,73.04
  Top 0.406: 54.68,67.41 L1.2 | C3.1 59.79,67.41 | 64.14,73.04 R20.2 | C48.1 69.1,69.12 C11T.1
  Top 0.533: 54.68,67.41 C3.1 | 59.79,67.41 64.13,71.75 66.75,69.14 C11T.1 70.01,69.14 REG1.3
_RESET  (via drill 0.5)
  Top 0.254: C2.1 95.83,41.58 v94.74,42.67
  Bottom 0.254: v94.74,42.67 94.74,46.23 96.77,48.26 96.77,49.28 96.01,50.04 93.73,50.04 GPIO_1.8
ADC
  Top 0.254: ADC-PAD.1 83.31,6.6 83.31,10.89 ESP-12.10
ADCSHUNT-A
  Top 0.254: MCP3208.1 52.38,54.41 45.47,47.5 41.15,47.5 36.92,51.73 R13.2
ADCSHUNT-B
  Top 0.254: R5.2 36.88,30.48 45.21,30.48 52.83,38.1 52.83,50.04 54.66,51.87 MCP3208.3
BST
  Top 0.533: C4.1 35.66,70.34 REG0.1
CH6
  Top 0.254: MCP3208.7 71.79,46.74 69.09,46.74 64.95,42.59 J5.2
CH7
  Top 0.254: MCP3208.8 71.79,45.47 69.85,45.47 67.49,43.1 J5.1
CH_PD
  Top 0.254: ESP-12.11 87.4,12.89 R7.1
D0/RX
  Top 0.254: GPIO_1.7 96.52,49.78 96.52,47.75 93.22,44.45 93.22,41.66 93.98,40.89 FTDI2.2
  Bottom 0.254: FTDI2.2 93.98,27.94 91.95,25.91 86.61,25.91 79.5,22.61 76.45,19.05 75.95,18.54 75.95,10.86 74.99,9.91 59.54,9.91 TX.2
D1/TX  (via drill 0.5)
  Top 0.254: FTDI2.3 91.44,31.24 v90.68,32 90.68,44.45 GPIO_1.9
  Bottom 0.254: FTDI2.3 91.44,27.69 90.42,26.67 86.36,26.67 78.99,23.37 75.95,19.81 75.18,19.05 75.18,12.19 74.42,11.43 63.09,11.43 RX.1
ESPRX
  Top 0.254: R18.1 68.87,10.87 ESP-12.7 | R17.2 66.34,10.89 R18.1 | R18.1 66.29,10.85 66.29,10.16 65.02,8.89 59.44,8.89 53.34,14.99 RX.2
ESPTX
  Top 0.254: FTDI1.2 74.42,12.95 70.36,8.89 ESP-12.8 67.62,7.62 57.4,7.62 48.25,16.77 TX.1
FB
  Top 0.254: REG0.4 60.73,74.15 60.96,73.91 60.96,73.24 | R21.2 R20.1
  Top 0.406: 60.96,73.24 R21.2
GND  (via drill 0.5, 3.2 pad 5.59)
  other vias: 10.08,67.21 92.07,67.23 10.08,9.2 92.07,9.2 31.88,28.79 30.72,40.88 31.85,47.34 19.02,72.85 23.36,72.9 32.26,24.63 21.23,67.95 79.18,52.33 74.44,52 77.22,43.82 78,69.78 76.22,68.25 84.85,68.51 86.63,70.54 64.79,69.01 66.86,65.75 70.41,73.11 67.33,74.47 58.27,71.01 72.95,72.93 82.17,72.87 78.22,59.46 86.87,62.55 41.55,73.04 34.77,73.06 40.34,65.71 40.27,64.31 65.44,64.6 33.58,40.42 24.2,2.65 24.94,14.18 70.95,22.83 66.79,23.42 72.7,42.83 72.95,38.77 86.67,39.28 89.43,39.32 38.03,13.38 50.22,31.16 57.08,39.29 48.71,39.16
  pour Bottom (isolate 0.127): 6.86,76.2 6.86,63.5 0.25,63.5 0.25,12.95 6.86,12.95 6.86,0.25 95.76,0.25 95.76,12.95 98.81,12.95 98.81,63.5 95.76,63.5 95.76,76.2
  pour Top (isolate 0.127): 6.86,76.2 6.86,63.5 0.25,63.5 0.25,12.95 6.86,12.95 6.86,0.25 95.76,0.25 95.76,12.95 98.81,12.95 98.81,63.5 95.76,63.5 95.76,76.2
GPIO0  (via drill 0.5)
  Top 0.254: R12.1 66.43,16.89 ESP-12.4 69.02,17.02 v71.37,17.02
  Bottom 0.254: v71.37,17.02 64.26,24.13 63.25,24.13 59.44,27.94 BOOTL.2
GPIO2  (via drill 0.5)
  Top 0.152: v71.5,18.89 v71.52,18.88
  Top 0.254: R6.1 66.34,18.89 ESP-12.3 v71.5,18.89 | v75.64,46.79 v75.65,46.79 MCP3208.10
  Bottom 0.254: v71.52,18.88 71.52,18.91 68.07,22.35 68.07,36.07 75.64,43.64 v75.64,46.79
GPIO12  (via drill 0.5)
  Top 0.254: U$4.PIN7 39.86,5.57 v41.91,3.56 | v72.92,3.65 73.02,3.56 76.71,3.56 81.03,7.87 81.03,15.75 v83.06,17.78 84.17,18.89 ESP-12.14 | 80.29,40.66 R8.2 | 80.29,40.66 80.77,41.15 82.14,41.15 R4.1 | v81.53,21.59 81.03,22.1 81.03,32.77 v75.69,38.1 | v81.53,39.12 81.53,39.42 80.29,40.66
  Bottom 0.254: v41.91,3.56 72.64,3.56 v72.92,3.65 | v83.06,17.78 83.06,20.07 v81.53,21.59 | v75.69,38.1 80.52,38.1 v81.53,39.12
GPIO12A
  Top 0.254: MCP3208.12 77.22,49.34 77.28,49.28 81.03,49.28 82.16,48.14 R4.2
GPIO13  (via drill 0.5)
  Top 0.254: 84.58,20.83 84.33,20.83 | 84.58,20.83 85.03,20.83 ESP-12.15 84.01,20.89 81.79,23.11 81.79,33.27 76.71,38.35 76.71,41.15 80.77,45.21 80.77,46.48 79.25,48.01 77.29,48.01 MCP3208.11 | U$4.PIN3 37.53,9.97 v42.67,5.08 | v71.63,4.83 76.2,4.83 79.76,8.38 79.76,16 84.58,20.83
  Bottom 0.254: v42.67,5.08 42.93,4.83 v71.63,4.83
GPIO14  (via drill 0.5)
  Top 0.254: v73.91,2.29 77.22,2.29 82.3,7.37 82.3,14.99 v82.93,15.62 84.2,16.89 ESP-12.13 | v81.53,19.81 80.01,21.34 80.01,32.26 74.68,37.59 74.68,49.53 75.69,50.55 76.45,50.55 76.51,50.6 MCP3208.13 | v35.45,7.69 35.31,7.77 U$4.PIN5
  Bottom 0.254: v73.91,2.29 41.16,2.29 35.65,7.79 v35.45,7.69 | v82.93,15.62 81.53,17.02 v81.53,19.81
GPIO15  (via drill 0.5)
  Top 0.254: R3.1 66.38,20.89 ESP-12.2 71.31,20.89 v71.37,20.83 | U$4.PIN2 38.72,11.07 v42.93,7.11 | v78.49,24.38 78.49,8.89 75.95,6.35 70.61,6.35 v70.36,6.1
  Bottom 0.254: v71.37,20.83 v78.49,24.38 | v70.36,6.1 43.94,6.1 v42.93,7.11
GPIO16
  Top 0.254: IO1.1 88.62,17.85 85.9,15.12 85.32,15.12 ESP-12.12
LOAD-NEG-A  (via drill 0.5, 0.8)  (32 unrouted)
  Top 0.152: 5.78,53.02 5.27,53.02
  Top 0.254: 7.02,53.69 22.34,53.69 SCREW1.1 27.27,53.03 | 27.27,53.03 SHUNTMON-A.8 | 27.27,53.03 27.61,53.03 C23.2
  Top 2.54: 7.02,53.69 SCREW_TERM_1.P$2
  other vias: 1.85,55.01 2.87,55.01 3.88,55.01 4.9,55.01 5.92,55.01 6.93,55.01 7.95,55.01 8.96,55.01 9.98,55.01 9.98,53.99 9.98,52.97 8.96,52.97 8.96,53.99 7.95,53.99 5.92,53.99 6.93,53.99 4.9,53.99 3.88,53.99 2.87,53.99 1.85,53.99 1.85,52.97 2.87,52.97 3.88,52.97 4.9,52.97 5.92,52.97 6.93,52.97 7.95,52.97 7.55,56.96 6.03,56.96 4.51,56.96 2.98,56.96
LOAD-NEG-B  (via drill 0.5, 0.8)  (32 unrouted)
  Top 0.152: SCREW_TERM_2.P$2 5.59,37.85 5.6,37.86 | 8.69,38.35 8.69,38.05 7.03,36.39 SCREW_TERM_2.P$2 | SCREW_TERM_2.P$2 5.59,37.59 5.39,37.79 | SCREW_TERM_2.P$2 5.91,36.39 7.25,37.73 | 5.78,34.48 5.27,34.48
  Top 0.254: SCREW_TERM_2.P$2 21.38,36.39 SCREW2.1 27.25,34.51 | 27.25,34.51 SHUNTMON-B.8 | 27.25,34.51 27.69,34.51 C24.2
  other vias: 7.81,38.42 6.28,38.42 4.76,38.42 3.24,38.42 1.85,36.46 2.87,36.46 3.88,36.46 4.9,36.46 5.92,36.46 6.93,36.46 7.95,36.46 8.96,36.46 9.98,36.46 9.98,35.45 9.98,34.43 8.96,34.43 8.96,35.45 7.95,35.45 5.92,35.45 6.93,35.45 4.9,35.45 3.88,35.45 2.87,35.45 1.85,35.45 1.85,34.43 2.87,34.43 3.88,34.43 4.9,34.43 5.92,34.43 6.93,34.43 7.95,34.43
LX
  Top 0.406: D1.C 33.96,65.32 33.96,65.79 34.08,65.91
  Top 0.533: REG0.8 33.96,70.34 C4.2 33.96,65.79 | L1.1 38.42,68.58 35.75,65.91 34.08,65.91
N$4
  Top 0.254: SHUNTMON-A.5 32.74,51.7 R13.1
N$6
  Top 0.254: SHUNTMON-B.5 32.5,33.16 R5.1
N$10
  Top 0.254: PCF8523.8 39.76,24.41 C7.1 39.36,26.71 R9.1
N$30  (via drill 0.5)
  Top 0.254: FTDI1.1 v76.96,9.91 | v91.95,23.62 C21.2
  Bottom 0.254: 90.17,16.51 88.9,15.24 | 90.17,16.51 91.95,18.29 v91.95,23.62 | v76.96,9.91 83.57,9.91 90.17,16.51
N$36
  Top 0.254: FTDI1.3 71.88,25.65 70.87,24.64 62.74,24.64 60.96,22.86 60.96,16.71 R17.1
N$43  (via drill 0.5)
  Top 0.254: PCF8523.3 42.23,16.98 v42.23,18.91
  Bottom 0.254: v42.23,18.91 41.83,19.57 CR1220.P+
N$44
  Top 0.254: Y1.P$4 51.88,5.52 41.15,16.26 41.15,16.87 PCF8523.2
N$45
  Top 0.254: Y1.P$1 53.81,2.32 39.88,16.26 39.88,16.84 PCF8523.1
N$301
  Top 0.254: 95.83,38.61 C2.2 | 95.83,38.61 95.83,38.43 95.76,38.35 | FTDI2.1 96.52,37.92 95.83,38.61
REF_A_INPUT
  Top 0.254: SHUNTMON-A.7 29.25,52.61 30.73,54.1 31.5,54.1 | SHUNTMON-A.6 29.9,52.5 31.5,54.1 | 31.5,54.1 41.06,54.1 REF_SEL_A.2
REF_B_INPUT
  Top 0.254: SHUNTMON-B.7 29.25,33.82 30.73,35.31 31.5,35.31 | 31.5,35.31 30.28,34.09 30.21,34.09 29.9,33.78 SHUNTMON-B.6 | 31.5,35.31 41.63,35.31 REF_SEL_B.2
REF_INPUT  (via drill 0.5)
  Top 0.254: REF_SEL_B.3 49.42,45.21 R10.1 | R11.2 59.49,49.33 MCP3208.5 | v47.21,51.64 47.21,51.73 42.49,56.45 REF_SEL_A.3
  Bottom 0.254: R11.2 R10.1 51.38,47.48 v47.21,51.64
RESTESP
  Top 0.254: R19.1 C21.1 91.95,14.99 85.85,8.89 ESP-12.9
SCL  (via drill 0.5)
  Top 0.254: ESP-12.5 71.03,14.89 v71.12,14.99 | PCF8523.6 42.26,21.5 43.18,20.57 49.78,20.57 52.58,23.37 52.58,26.66 P1.2
  Bottom 0.254: v71.12,14.99 64.38,14.99 P1.2
SDA  (via drill 0.5)
  Top 0.254: ESP-12.6 70.8,12.89 v70.87,12.95 | PCF8523.5 48.67,22.26 50.65,24.23 P1.1
  Bottom 0.254: v70.87,12.95 64.41,12.95 P1.1
SOURCE-POS-A  (via drill 0.5, 0.8)  (27 unrouted)
  Top 0.152: SCREW_TERM_1.P$1 5.59,42.93 v4.76,42.1 | SCREW_TERM_1.P$1 5.59,42.8 v6.28,42.1 | SCREW_TERM_1.P$1 5.78,44.13 v7.81,42.1 | SCREW_TERM_1.P$1 5.27,44.13 v3.24,42.1
  Top 0.254: SCREW_TERM_1.P$1 21.1,44.13 SCREW1.3 27.24,46.03 | 27.24,46.03 SHUNTMON-A.1 | 27.24,46.03 27.71,46.03 C25.1 | v32.58,46.06 34.55,46.06 R14.2
  Bottom 0.254: SCREW1.3 32.54,46.03 v32.58,46.06
  Bottom 0.813: SCREW1.3 24.69,45.78 32.29,53.38 PWR.3
  other vias: 1.85,46.12 2.87,46.12 3.88,46.12 4.9,46.12 5.92,46.12 6.93,46.12 7.95,46.12 8.96,46.12 9.98,46.12 9.98,45.1 9.98,44.08 8.96,44.08 8.96,45.1 7.95,45.1 5.92,45.1 6.93,45.1 4.9,45.1 3.88,45.1 2.87,45.1 1.85,45.1 1.85,44.08 2.87,44.08 3.88,44.08 4.9,44.08 5.92,44.08 6.93,44.08 7.95,44.08
SOURCE-POS-B  (via drill 0.5, 0.8)  (31 unrouted)
  Top 0.152: SCREW_TERM_2.P$1 5.59,24.39 | SCREW_TERM_2.P$1 5.59,24.25 | SCREW_TERM_2.P$1 5.78,25.59 | SCREW_TERM_2.P$1 5.27,25.59
  Top 0.254: SCREW_TERM_2.P$1 20.83,25.59 SCREW2.3 27.26,27.51 | 27.26,27.51 SHUNTMON-B.1 | 27.26,27.51 27.64,27.51 C6.1 | v32.56,27.41 34.43,27.41 R1.2
  Bottom 0.254: SCREW2.3 32.46,27.51 v32.56,27.41
  Bottom 0.813: SCREW2.3 24.97,27.51 37.37,39.91 PWR.1
  other vias: 8.06,23.56 6.54,23.56 5.01,23.56 3.49,23.56 1.85,27.57 2.87,27.57 3.88,27.57 4.9,27.57 5.92,27.57 6.93,27.57 7.95,27.57 8.96,27.57 9.98,27.57 9.98,26.56 9.98,25.54 8.96,25.54 8.96,26.56 7.95,26.56 5.92,26.56 6.93,26.56 4.9,26.56 3.88,26.56 2.87,26.56 1.85,26.56 1.85,25.54 2.87,25.54 3.88,25.54 4.9,25.54 5.92,25.54 6.93,25.54 7.95,25.54
V_IN
  Top 0.406: 29.27,68.48 30.46,68.48 C16.1
  Top 0.533: C16.1 30.47,71.61 | 30.47,71.61 30.47,74.15 REG0.5 | 30.47,71.61 REG0.7
  Top 0.813: PWR.2 34.8,59.34 34.8,60.71 32.77,62.74 21.34,62.74 | 30.46,68.48 26.98,68.48 21.34,62.83 21.34,62.74 | C16.1 30.48,68.48 | 21.34,62.74 21.23,62.64 C10.1
VD
  Top 0.533: C5.1 REG0.2
VSENSEA
  Top 0.254: 35.05,43.94 R15.2 | 35.05,43.94 R14.1 | MCP3208.2 53.14,53.14 44.06,44.06 35.05,44.06 35.05,43.94
VSENSEB
  Top 0.254: 36.58,26.16 37.08,26.67 | 37.08,26.67 39.88,29.46 45.72,29.46 53.85,37.59 53.85,49.28 55.17,50.6 MCP3208.4 | 35.56,26.16 R1.1 | 35.56,26.16 R2.2 | 37.08,26.67 36.45,26.04 35.56,26.04 35.56,26.16
(copper drawn outside any net)
  shapes: Bottom area x4, Top area x4

### Text on the board
tPlace: VSENSE-A | VSENSE-B | MicroSD
bPlace: emonDC | wireless energy monitoring node | Technology that helps us live within ecological limits | Designed in North Wales UK by Megni | Node: | OpenEnergyMonitor.org | Designed in | North Wales | Made in UK | Open-Hardware | Format MicroSD / card to FAT32. / Place blank 'datalog.txt' / file there. | Lead free PCB - RoHS components
tNames: 16V | 80V | 100uF | 470uF | 150uH | A | B | - | BI | USB_PWR | LOAD | UNI | A | GND | LMP8481 | SOURCE | + | - | BI | CH6 CH7 / ADC | LOAD | disconnect module / before FTDI flash | UNI | B | GND | LMP8481 | SOURCE | I2C | + | LCD | TX / RX | CRYSTAL 8x3.8mm / 32KHz
tSilk: RFM69Pi / RF MODULE | GND | GND | 5V | Tx | Rx | RST | emonDCduo | Wireless Energy / Monitoring Node | v1.3 Dec 2017 by DB
_tsilk: Designed in | North Wales | Made in UK
_bsilk: SMT V0.6 rev3 | emonTx | wireless energy monitoring node | SMT V0.6 rev3 | emonTx | SMT V0.6 rev3 | emonTx | Technology that helps us live within ecological limits | wireless energy monitoring node | wireless energy monitoring node | Designed in North Wales UK by Glyn Hudson & Trystan Lea | Technology that helps us live within ecological limits | Technology that helps us live within ecological limits | Designed in North Wales UK by Glyn Hudson & Trystan Lea | 165mm ant | 433Mhz | Designed in North Wales UK by Glyn Hudson & Trystan Lea | 165mm ant | 165mm ant | 433Mhz | 433Mhz | 868Mhz | 82mm ant | 82mm ant | 82mm ant | 868Mhz | 868Mhz | 78mm ant | 915Mhz | 78mm ant | 915Mhz | 78mm ant | 915Mhz | 165mm ant | 433Mhz | 82mm ant | 868Mhz | 78mm ant | 915Mhz